# EAGLE design Roaster Control - Rev I (EAGLE 9.1.1)
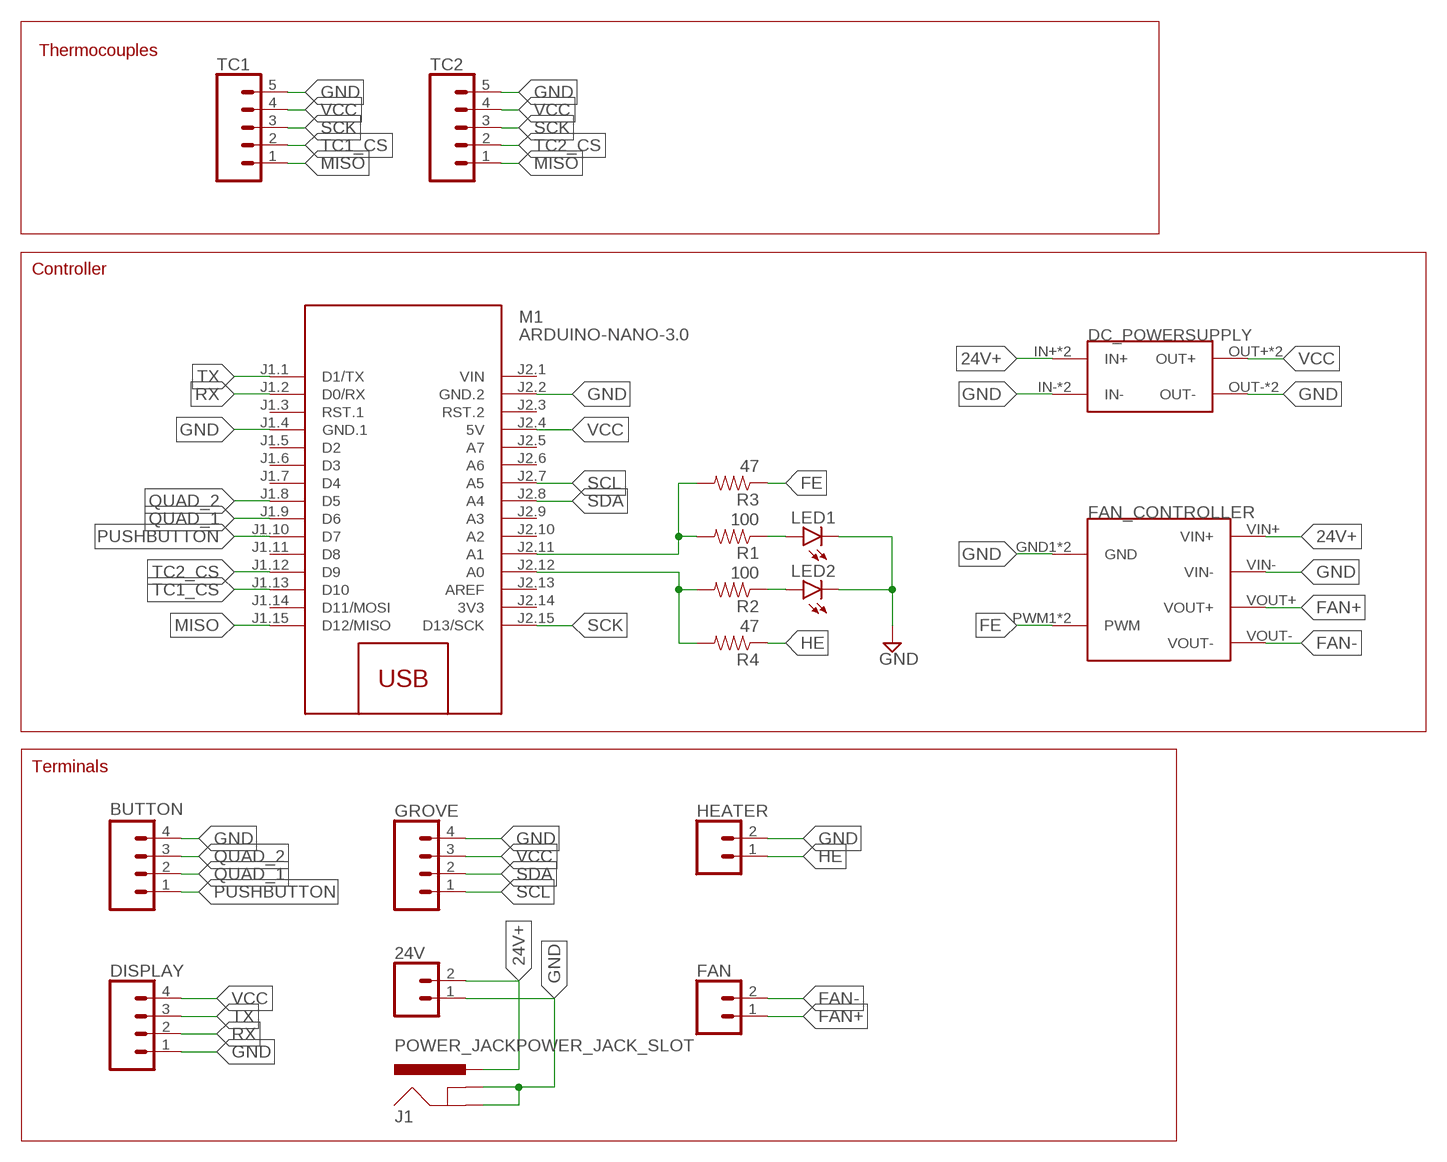
[diagram p0: schematic, sheet 1]

## Parts
24V  CONN_02PTH3  [1X02_LONGPADS]
BUTTON  M04LONGPADS  [1X04_LONGPADS]
DC_POWERSUPPLY  DCDC  [DCDC_FP]
DISPLAY  CONN_04LONGPADS  [1X04_LONGPADS]
FAN  CONN_02PTH3  [1X02_LONGPADS]
FAN_CONTROLLER  DC_MC  [DC_MC_FP]
GROVE  CONN_04LONGPADS  [1X04_LONGPADS]
HEATER  CONN_02PTH3  [1X02_LONGPADS]
J1  POWER_JACKPOWER_JACK_SLOT  [POWER_JACK_PTH_SLOT]
LED1  LEDCHIP-LED0805  [CHIP-LED0805]
LED2  LEDCHIP-LED0805  [CHIP-LED0805]
M1  ARDUINO-NANO-3.0  [ARDUINO-NANO-3.0]
R1  100  RESISTOR0603  [0603]
R2  100  RESISTOR0603  [0603]
R3  47  RESISTOR0603  [0603]
R4  47  RESISTOR0603  [0603]
TC1  CONN_05PTH_LONGPADS  [1X05_LONGPADS]
TC2  CONN_05PTH_LONGPADS  [1X05_LONGPADS]

## Nets
24V+ [current]: 24V.2 DC_POWERSUPPLY.IN+ DC_POWERSUPPLY.IN+2(IN+) FAN_CONTROLLER.VIN+ J1.PWR
FAN+ [current]: FAN.1 FAN_CONTROLLER.VOUT+
FAN- [current]: FAN.2 FAN_CONTROLLER.VOUT-
FAN_EN: M1.J2.11(A1) R1.2 R3.2
FE: FAN_CONTROLLER.PWM1(PWM) FAN_CONTROLLER.PWM2(PWM) R3.1
GND [current]: 24V.1 BUTTON.4 DC_POWERSUPPLY.IN- DC_POWERSUPPLY.IN-2(IN-) DC_POWERSUPPLY.OUT- DC_POWERSUPPLY.OUT-2(OUT-) DISPLAY.1 FAN_CONTROLLER.GND1(GND) FAN_CONTROLLER.GND2(GND) FAN_CONTROLLER.VIN- GROVE.4 HEATER.2 J1.GND J1.GNDBREAK LED1.C LED2.C M1.J1.4(GND.1) M1.J2.2(GND.2) TC1.5 TC2.5
HE: HEATER.1 R4.1
HEAT_EN: M1.J2.12(A0) R2.2 R4.2
MISO: M1.J1.15(D12/MISO) TC1.1 TC2.1
N$1: LED1.A R1.1
N$2: LED2.A R2.1
PUSHBUTTON: BUTTON.1 M1.J1.10(D7)
QUAD_1: BUTTON.2 M1.J1.9(D6)
QUAD_2: BUTTON.3 M1.J1.8(D5)
RX: DISPLAY.2 M1.J1.2(D0/RX)
SCK: M1.J2.15(D13/SCK) TC1.3 TC2.3
SCL: GROVE.1 M1.J2.7(A5)
SDA: GROVE.2 M1.J2.8(A4)
TC1_CS: M1.J1.13(D10) TC1.2
TC2_CS: M1.J1.12(D9) TC2.2
TX: DISPLAY.3 M1.J1.1(D1/TX)
VCC [POWER]: DC_POWERSUPPLY.OUT+ DC_POWERSUPPLY.OUT+2(OUT+) DISPLAY.4 GROVE.3 M1.J2.4(5V) TC1.4 TC2.4
Unconnected: M1.J1.3(RST.1) M1.J1.5(D2) M1.J1.6(D3) M1.J1.7(D4) M1.J1.11(D8) M1.J1.14(D11/MOSI) M1.J2.3(RST.2) M1.J2.5(A7) M1.J2.6(A6) M1.J2.9(A3) M1.J2.10(A2) M1.J2.13(AREF)

## Notes on the sheet
- Thermocouples
- Controller
- Terminals

## Power pins joined to a net without a drawn wire
3V3: M1.J2.14(3V3)
VIN: M1.J2.1(VIN)

## Library data of the parts
24V FAN HEATER = SparkFun-Connectors:CONN_02: Multi connection point. Often used as Generic Header-pin footprint for 0.1 inch spaced/style header connections On any of the 0.1 inch spaced packages, you can populate with these: Break Away Headers - Straight <https://www.sparkfun.com/products/116> (PRT-00116) Break Away Male Headers - Right Angle <https://www.sparkfun.com/products/553> (PRT-00553) Female Headers <https://www.sparkfun.com/products/115> (PRT-00115) Break Away Headers - Machine Pin <https://www.sparkfun.com/products/117> (PRT-00117) Break Away Female Headers - Swiss Machine Pin <https://www.sparkfun.com/products/743> (PRT-00743) For SCREWTERMINALS and SPRING TERMINALS visit here: Screw Terimnals on SparkFun.com <https://www.sparkfun.com/search/results?term=Screw+Terminals> (5mm/3.5mm/2.54mm spacing) This device is also useful as a general connection point to wire up your design to another part of your project. Our various solder wires solder well into these plated through hole pads. Hook-Up Wire - Assortment (Stranded, 22 AWG) <https://www.sparkfun.com/products/11375> (PRT-11375) Hook-Up Wire - Assortment (Solid Core, 22 AWG) <https://www.sparkfun.com/products/11367> (PRT-11367) View the entire wire category on our website here <https://www.sparkfun.com/categories/141> Special notes: Molex polarized connector foot print use with: PRT-08233 with associated crimp pins and housings. 2.54_SCREWTERM for use with PRT-10571. 3.5mm Screw Terminal footprints for PRT-08084 5mm Screw Terminal footprints for use with PRT-08432
BUTTON = SparkFun:M04: Header 4 Standard 4-pin 0.1" header. Use with straight break away headers (SKU : PRT-00116), right angle break away headers (PRT-00553), swiss pins (PRT-00743), machine pins (PRT-00117), and female headers (PRT-00115). Molex polarized connector foot print use with SKU : PRT-08231 with associated crimp pins and housings. 1MM SMD Version SKU: PRT-10208
DC_POWERSUPPLY = Roaster Control - Custom Parts:DCDC
DISPLAY GROVE = SparkFun-Connectors:CONN_04: Multi connection point. Often used as Generic Header-pin footprint for 0.1 inch spaced/style header connections On any of the 0.1 inch spaced packages, you can populate with these: Break Away Headers - Straight <https://www.sparkfun.com/products/116> (PRT-00116) Break Away Male Headers - Right Angle <https://www.sparkfun.com/products/553> (PRT-00553) Female Headers <https://www.sparkfun.com/products/115> (PRT-00115) Break Away Headers - Machine Pin <https://www.sparkfun.com/products/117> (PRT-00117) Break Away Female Headers - Swiss Machine Pin <https://www.sparkfun.com/products/743> (PRT-00743) For SCREWTERMINALS and SPRING TERMINALS visit here: Screw Terimnals on SparkFun.com <https://www.sparkfun.com/search/results?term=Screw+Terminals> (5mm/3.5mm/2.54mm spacing) This device is also useful as a general connection point to wire up your design to another part of your project. Our various solder wires solder well into these plated through hole pads. Hook-Up Wire - Assortment (Stranded, 22 AWG) <https://www.sparkfun.com/products/11375> (PRT-11375) Hook-Up Wire - Assortment (Solid Core, 22 AWG) <https://www.sparkfun.com/products/11367> (PRT-11367) View the entire wire category on our website here <https://www.sparkfun.com/categories/141> Special notes: Molex polarized connector foot print use with SKU : PRT-08231 with associated crimp pins and housings. 1MM SMD Version SKU: PRT-10208; PROD_ID: CONN-09696
FAN_CONTROLLER = Roaster Control - Custom Parts:DC_MC
J1 = SparkFun-Connectors:POWER_JACK: Power Jack Connector This is the standard 5.5mm barrel jack for power. The PTH is the most common, proven, reliable, footprint. The Slot footprint only works if the mill layer is transmitted to the PCB fab house so be warned. Here are the connectors we sell at SparkFun: DC Barrel Power Jack/Connector <https://www.sparkfun.com/products/119> (PRT-00119) DC Barrel Power Jack/Connector (SMD) <https://www.sparkfun.com/products/12748> (PRT-12748) DC Barrel Jack Adapter - Breadboard Compatible <https://www.sparkfun.com/products/10811> (PRT-10811) It is used on this SparkFun product (and many, many others): SparkFun RedBoard - Programmed with Arduino <https://www.sparkfun.com/products/12757> (DEV-12757) Also, if you need a mating power supply or connector, please check these out: Wall Adapter Power Supply - 9VDC 650mA <https://www.sparkfun.com/products/298> (TOL-00298) DC Barrel Jack Adapter - Male <https://www.sparkfun.com/products/10287> (PRT-10287); PROD_ID: CONN-08197
LED1 LED2 = led:LED: LED OSRAM: - CHIPLED LG R971, LG N971, LY N971, LG Q971, LY Q971, LO R971, LY R971 LH N974, LH R974 LS Q976, LO Q976, LY Q976 LO Q996 - Hyper CHIPLED LW Q18S LB Q993, LB Q99A, LB R99A - SideLED LS A670, LO A670, LY A670, LG A670, LP A670 LB A673, LV A673, LT A673, LW A673 LH A674 LY A675 LS A676, LA A676, LO A676, LY A676, LW A676 LS A679, LY A679, LG A679 - Hyper Micro SIDELED® LS Y876, LA Y876, LO Y876, LY Y876 LT Y87S - SmartLED LW L88C, LW L88S LB L89C, LB L89S, LG L890 LS L89K, LO L89K, LY L89K LS L896, LA L896, LO L896, LY L896 - TOPLED LS T670, LO T670, LY T670, LG T670, LP T670 LSG T670, LSP T670, LSY T670, LOP T670, LYG T670 LG T671, LOG T671, LSG T671 LB T673, LV T673, LT T673, LW T673 LH T674 LS T676, LA T676, LO T676, LY T676, LB T676, LH T676, LSB T676, LW T676 LB T67C, LV T67C, LT T67C, LS T67K, LO T67K, LY T67K, LW E67C LS E67B, LA E67B, LO E67B, LY E67B, LB E67C, LV E67C, LT E67C LW T67C LS T679, LY T679, LG T679 LS T770, LO T770, LY T770, LG T770, LP T770 LB T773, LV T773, LT T773, LW T773 LH T774 LS E675, LA E675, LY E675, LS T675 LS T776, LA T776, LO T776, LY T776, LB T776 LHGB T686 LT T68C, LB T68C - Hyper Mini TOPLED® LB M676 - Mini TOPLED Santana® LG M470 LS M47K, LO M47K, LY M47K Source: http://www.osram.convergy.de LUXEON: - LUMILED® LXK2-PW12-R00, LXK2-PW12-S00, LXK2-PW14-U00, LXK2-PW14-V00 LXK2-PM12-R00, LXK2-PM12-S00, LXK2-PM14-U00 LXK2-PE12-Q00, LXK2-PE12-R00, LXK2-PE12-S00, LXK2-PE14-T00, LXK2-PE14-U00 LXK2-PB12-K00, LXK2-PB12-L00, LXK2-PB12-M00, LXK2-PB14-N00, LXK2-PB14-P00, LXK2-PB14-Q00 LXK2-PR12-L00, LXK2-PR12-M00, LXK2-PR14-Q00, LXK2-PR14-R00 LXK2-PD12-Q00, LXK2-PD12-R00, LXK2-PD12-S00 LXK2-PH12-R00, LXK2-PH12-S00 LXK2-PL12-P00, LXK2-PL12-Q00, LXK2-PL12-R00 Source: www.luxeon.com KINGBRIGHT: KA-3528ASYC Source: www.kingbright.com
M1 = diy-modules:ARDUINO-NANO-3.0: Arduino Nano 3.0 and compatible devices More details available here: https://www.arduino.cc/en/Main/ArduinoBoardNano Click here to find device on ebay.com <http://www.ebay.com/sch/arduino+nano>
R1-R4 = SparkFun03_30_09:RESISTOR: Resistor Basic schematic elements and footprints for 0603, 1206, and PTH 1/10th watt (small) resistors.
TC1 TC2 = SparkFun-Connectors:CONN_05: Multi connection point. Often used as Generic Header-pin footprint for 0.1 inch spaced/style header connections On any of the 0.1 inch spaced packages, you can populate with these: Break Away Headers - Straight <https://www.sparkfun.com/products/116> (PRT-00116) Break Away Male Headers - Right Angle <https://www.sparkfun.com/products/553> (PRT-00553) Female Headers <https://www.sparkfun.com/products/115> (PRT-00115) Break Away Headers - Machine Pin <https://www.sparkfun.com/products/117> (PRT-00117) Break Away Female Headers - Swiss Machine Pin <https://www.sparkfun.com/products/743> (PRT-00743) For SCREWTERMINALS and SPRING TERMINALS visit here: Screw Terimnals on SparkFun.com <https://www.sparkfun.com/search/results?term=Screw+Terminals> (5mm/3.5mm/2.54mm spacing) This device is also useful as a general connection point to wire up your design to another part of your project. Our various solder wires solder well into these plated through hole pads. Hook-Up Wire - Assortment (Stranded, 22 AWG) <https://www.sparkfun.com/products/11375> (PRT-11375) Hook-Up Wire - Assortment (Solid Core, 22 AWG) <https://www.sparkfun.com/products/11367> (PRT-11367) View the entire wire category on our website here <https://www.sparkfun.com/categories/141> Special notes: Molex polarized connector foot print use with SKU : PRT-08231 with associated crimp pins and housings. 1MM SMD Version SKU: PRT-10208

## Net classes
0 default: width 0.305 mm, clearance 0.152 mm
1 POWER: width 0.406 mm
2 current: width 0.61 mm, clearance 0.61 mm

## Board
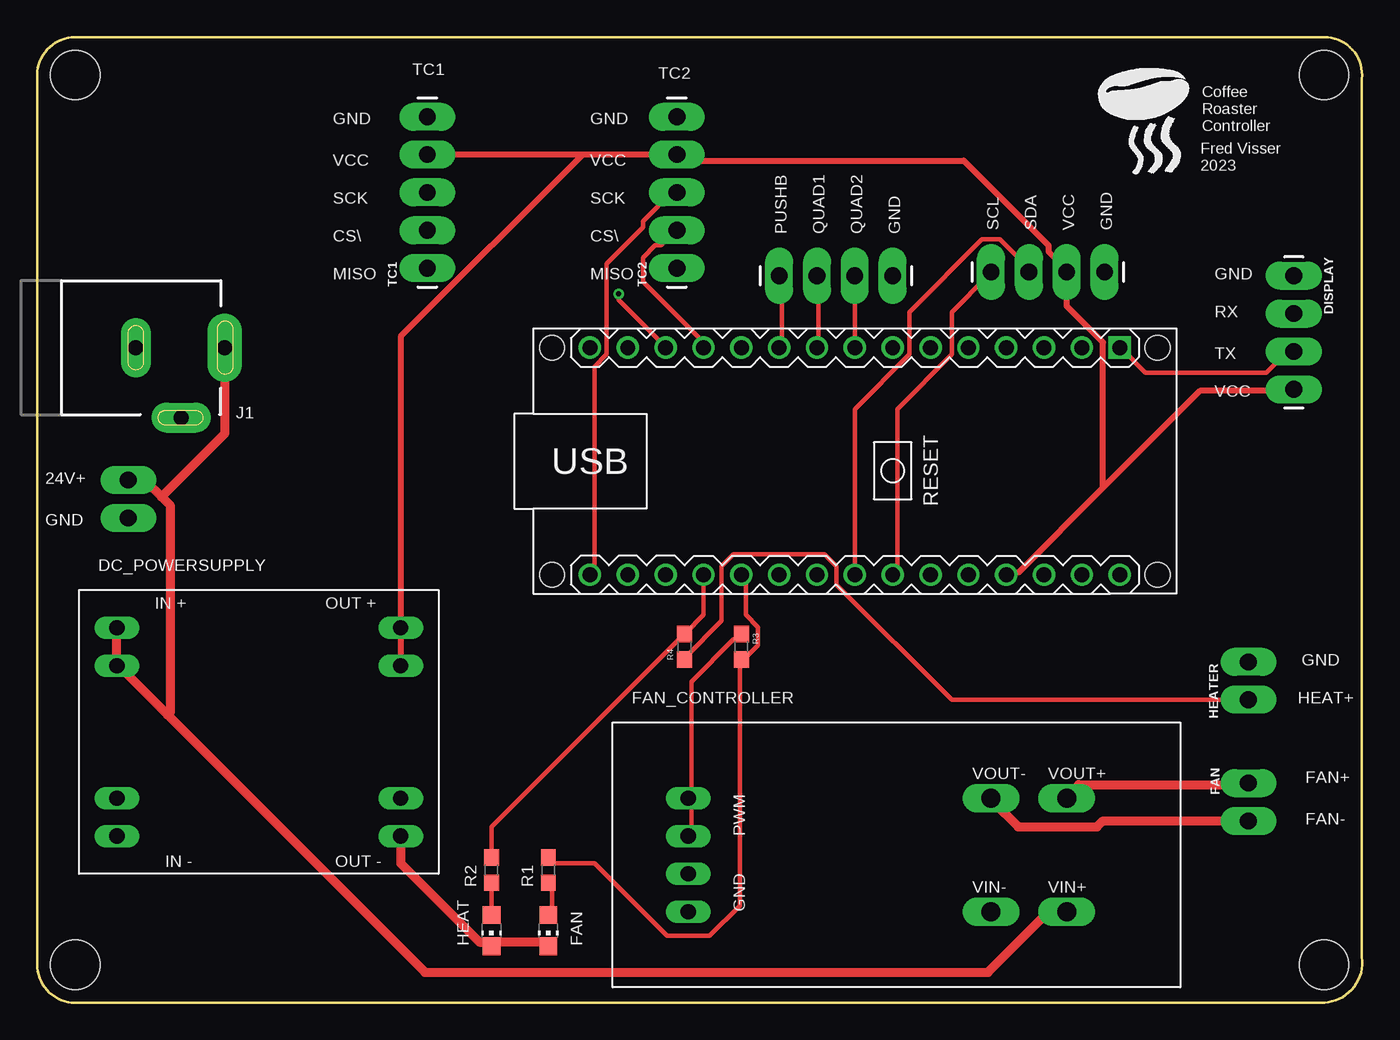
[diagram p1: board, top side]
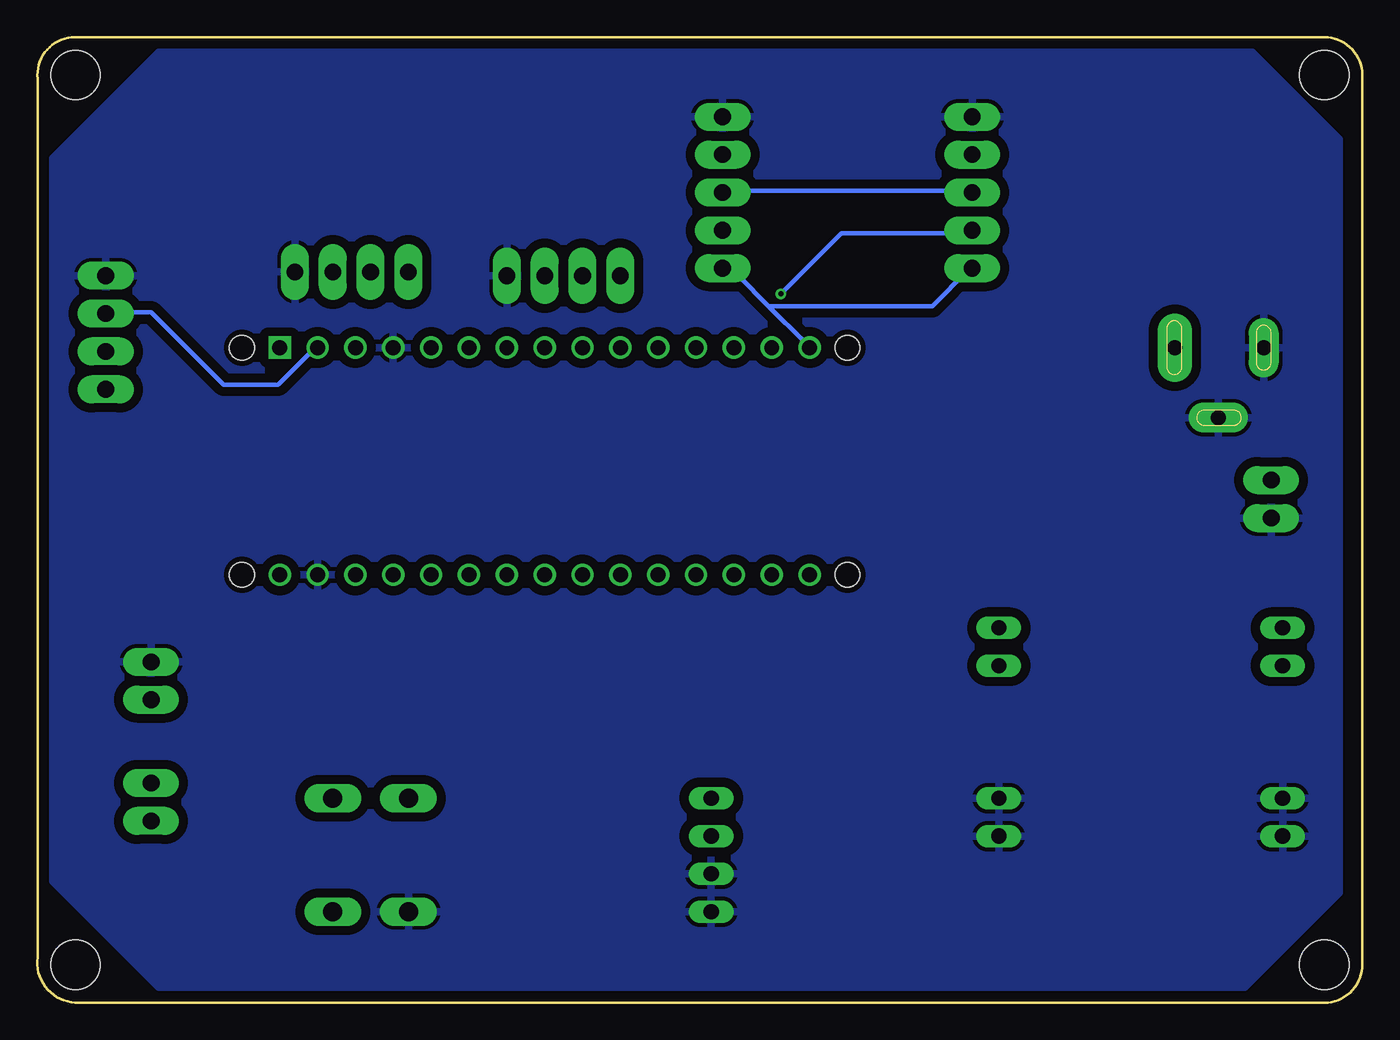
[diagram p2: board, bottom side, seen from below]

Size 88.94 x 64.77 mm. Coordinates in mm from the lower left corner, seen from the top.
Outline: 0.01,2.79 0.01,62.48 arc-84 2.55,64.77 86.63,64.77 arc-90 88.91,61.98 88.91,3.05 arc-101 86.12,0 2.3,0 arc-90 0.01,2.79
Copper layers (1*16): Top 0.0356mm / dielectric 1.5011mm / Bottom 0.0356mm
Design rules "default": minimum track width 6mil, minimum drill 13mil, track to track 6mil, track to pad 6mil, pad to pad 6mil, via to via 6mil, smd to smd 6mil, copper to edge 15mil, drill to drill 6mil, minimum pad ring 7mil, minimum via ring 7mil, stop-mask expansion 3mil, vias tented up to drill 0mil, thermal gap 10mil
Holes 3.3 mm at 2.55,2.54 86.37,2.54 86.37,62.23 2.55,62.23

### Footprints (pad centres in the part's own frame; a part is rotated, then mirrored left to right if it is on the bottom)
1X02_LONGPADS = drill 1.118 pad 1.88 long: 1 0,0; 2 2.54,0
1X04_LONGPADS = drill 1.118 pad 1.88 long: 1 0,0; 2 2.54,0; 3 5.08,0; 4 7.62,0
DCDC_FP = drill 1.016 long: IN+ -10.16,7.62; IN+2 -10.16,5.08; IN- -10.16,-3.81; IN-2 -10.16,-6.35; OUT+ 8.89,7.62; OUT+2 8.89,5.08; OUT- 8.89,-3.81; OUT-2 8.89,-6.35
DC_MC_FP = drill 1.016 long: GND1 -13.97,-1.27; GND2 -13.97,-3.81; PWM1 -13.97,3.81; PWM2 -13.97,1.27 | drill 1.27 long: VIN+ 11.43,-3.81; VIN- 6.35,-3.81; VOUT+ 11.43,3.81; VOUT- 6.35,3.81
POWER_JACK_PTH_SLOT = drill 1 pad 2 long: GND 0,0; GNDBREAK -3.048,4.699 | drill 1 pad 2.3 long: PWR -5.969,0
CHIP-LED0805 = smd 1.2 x 1.2: A 0,-1.05; C 0,1.05
ARDUINO-NANO-3.0 = drill 1 square: J1.1 17.78,7.62 | drill 1: J1.2 15.24,7.62; J1.3 12.7,7.62; J1.4 10.16,7.62; J1.5 7.62,7.62; J1.6 5.08,7.62; J1.7 2.54,7.62; J1.8 0,7.62; J1.9 -2.54,7.62; J1.10 -5.08,7.62; J1.11 -7.62,7.62; J1.12 -10.16,7.62; J1.13 -12.7,7.62; J1.14 -15.24,7.62; J1.15 -17.78,7.62; J2.1 17.78,-7.62; J2.2 15.24,-7.62; J2.3 12.7,-7.62; J2.4 10.16,-7.62; J2.5 7.62,-7.62; J2.6 5.08,-7.62; J2.7 2.54,-7.62; J2.8 0,-7.62; J2.9 -2.54,-7.62; J2.10 -5.08,-7.62; J2.11 -7.62,-7.62; J2.12 -10.16,-7.62; J2.13 -12.7,-7.62; J2.14 -15.24,-7.62; J2.15 -17.78,-7.62 | hole 1.651: -20.32,7.62; -20.32,-7.62; 20.32,-7.62; 20.32,7.62
0603 = smd 1.1 x 1: 1 -0.85,0; 2 0.85,0
1X05_LONGPADS = drill 1.118 pad 1.88 long: 1 0,0; 2 2.54,0; 3 5.08,0; 4 7.62,0; 5 10.16,0

### Placement (x,y rotation side)
24V  6.11,32.51 90 top
BUTTON  49.8,48.77 0 top
DC_POWERSUPPLY  15.51,17.53 0 top
DISPLAY  84.34,48.77 270 top
FAN  81.29,14.73 270 top
FAN_CONTROLLER  57.67,9.91 0 top
GROVE  64.02,49.02 0 top
HEATER  81.29,20.32 90 top
J1  6.62,43.94 180 top
LED1  34.3,4.83 180 top
LED2  30.49,4.83 180 top
M1  54.88,36.32 0 top
R1  34.3,8.89 90 top
R2  30.49,8.89 90 top
R3  47.26,23.88 270 top
R4  43.45,23.88 90 top
TC1  26.17,49.28 90 top
TC2  42.94,49.28 90 top
U$1  [LOGO]  71.02,55.32 0 top

### Tracks (layer width: path | path; a pad name or v marks a point on that pad's centre or on a via)
24V+
  Top 0.61: DC_POWERSUPPLY.IN+ 5.3,24.79 5.3,22.76 DC_POWERSUPPLY.IN+2 5.7,22.35 8.75,19.3 | FAN_CONTROLLER.VIN+ 67.88,6.1 63.82,2.03 26.02,2.03 8.75,19.3 | 8.34,33.93 8.95,33.33 8.95,19.51 8.75,19.3 | 8.34,33.93 7.33,34.95 6.11,34.95 24V.2 | J1.PWR 12.61,43.89 12.61,38.2 8.55,34.14 8.34,33.93
FAN+
  Top 0.61: FAN.1 81.29,14.63 69.91,14.63 69.1,13.82 FAN_CONTROLLER.VOUT+
FAN-
  Top 0.61: FAN.2 71.54,12.19 71.13,11.79 65.85,11.79 64.22,13.41 FAN_CONTROLLER.VOUT-
FAN_EN
  Top 0.305: R1.2 34.56,9.35 37.4,9.35 42.28,4.47 45.12,4.47 47.15,6.5 47.15,22.76 R3.2 47.56,23.17 48.37,23.98 48.37,25.2 47.56,26.01 47.56,28.45 M1.J2.11
FE
  Top 0.305: R3.1 47.15,24.38 46.75,24.38 43.9,21.54 43.9,13.82 FAN_CONTROLLER.PWM1 43.9,13.41 43.9,11.38 FAN_CONTROLLER.PWM2
GND
  Top 0.61: 30.49,4.06 34.15,4.06 LED1.C | 30.49,4.06 LED2.C 30.49,4.06 | 30.49,4.06 29.68,4.06 24.4,9.35 24.4,10.97 DC_POWERSUPPLY.OUT-2
  pour Bottom: 7.38,63.75 80.78,63.75 87.9,56.64 87.9,8.13 80.78,1.02 7.89,1.02 1.54,7.37 1.54,57.91
HE
  Top 0.305: HEATER.1 61.38,20.32 53.66,28.04 53.66,29.26 52.84,30.07 46.75,30.07 45.94,29.26 45.94,25.6 43.5,23.17 R4.1
HEAT_EN
  Top 0.305: R2.2 30.49,9.75 30.49,11.79 43.09,24.38 R4.2 43.5,24.79 44.72,26.01 44.72,28.45 M1.J2.12
MISO
  Bottom 0.305: 39.84,46.74 41.87,48.77 42.43,48.77 TC2.1 | 39.84,46.74 37.4,44.3 M1.J1.15 | 39.84,46.74 28.87,46.74 26.43,49.17 TC1.1
N$1
  Top 0.305: R1.1 34.56,7.72 34.56,6.1 LED1.A
N$2
  Top 0.305: R2.1 30.49,7.72 30.49,6.1 LED2.A
PUSHBUTTON
  Top 0.305: M1.J1.10 50,44.3 50,48.77 BUTTON.1
QUAD_1
  Top 0.305: M1.J1.9 52.44,44.3 52.44,48.77 BUTTON.2
QUAD_2
  Top 0.305: BUTTON.3 54.88,44.3 M1.J1.8
RX
  Bottom 0.305: M1.J1.2 70.32,43.89 72.76,41.45 76.42,41.45 81.29,46.33 84.14,46.33 DISPLAY.2
SCK
  Top 0.305: M1.J2.15 37.4,28.85 37.4,42.67 38.21,43.49 38.21,49.58 40.65,52.02 40.65,52.43 42.68,54.46 TC2.3 42.93,54.29
  Bottom 0.305: TC1.3 26.43,54.46 42.87,54.46 TC2.3
SCL
  Top 0.305: M1.J2.7 57.72,28.85 57.72,39.83 61.38,43.49 61.38,46.33 63.82,48.77 GROVE.1
SDA
  Top 0.305: M1.J2.8 54.88,28.85 54.88,39.83 58.53,43.49 58.53,46.33 63.41,51.21 64.63,51.21 66.66,49.17 GROVE.2
TC1_CS  (via drill 0.33)
  Top 0.305: v39.03,47.55 39.03,47.14 41.87,44.3 M1.J1.13
  Bottom 0.305: v39.03,47.55 34.96,51.61 26.43,51.61 TC1.2
TC2_CS
  Top 0.305: M1.J1.12 44.72,44.3 40.65,48.36 40.65,49.58 40.65,49.99 41.47,50.8 41.87,50.8 42.68,51.61 TC2.2 42.9,51.82
TX
  Top 0.305: M1.J1.1 72.76,43.89 74.38,42.27 82.51,42.27 84.14,43.89 DISPLAY.3
VCC
  Top 0.406: 71.54,34.54 78.04,41.05 84.14,41.05 DISPLAY.4 | 71.54,34.54 65.85,28.85 65.04,28.85 M1.J2.4 | 71.54,34.54 71.54,44.3 69.1,46.74 69.1,48.77 GROVE.3 69.1,49.17 67.88,50.39 67.88,50.8 62.19,56.49 43.34,56.49 TC2.4 36.59,56.9 | DC_POWERSUPPLY.OUT+2 24.4,22.76 24.4,24.79 DC_POWERSUPPLY.OUT+ 24.4,25.2 24.4,44.7 36.59,56.9 | 36.59,56.9 26.43,56.9 TC1.4

### Text on the board
tNames: TC1 | TC2 | GND | GND | VCC | VCC | SCK | SCK | PUSHB | QUAD1 | QUAD2 | GND | SCL | SDA | VCC | GND | CS\ | CS\ | MISO | MISO | GND | RX | TX | VCC | 24V+ | GND | GND | HEAT+ | FAN+ | FAN- | HEAT | FAN